# EAGLE design rgbw2 (EAGLE 6.6.0)
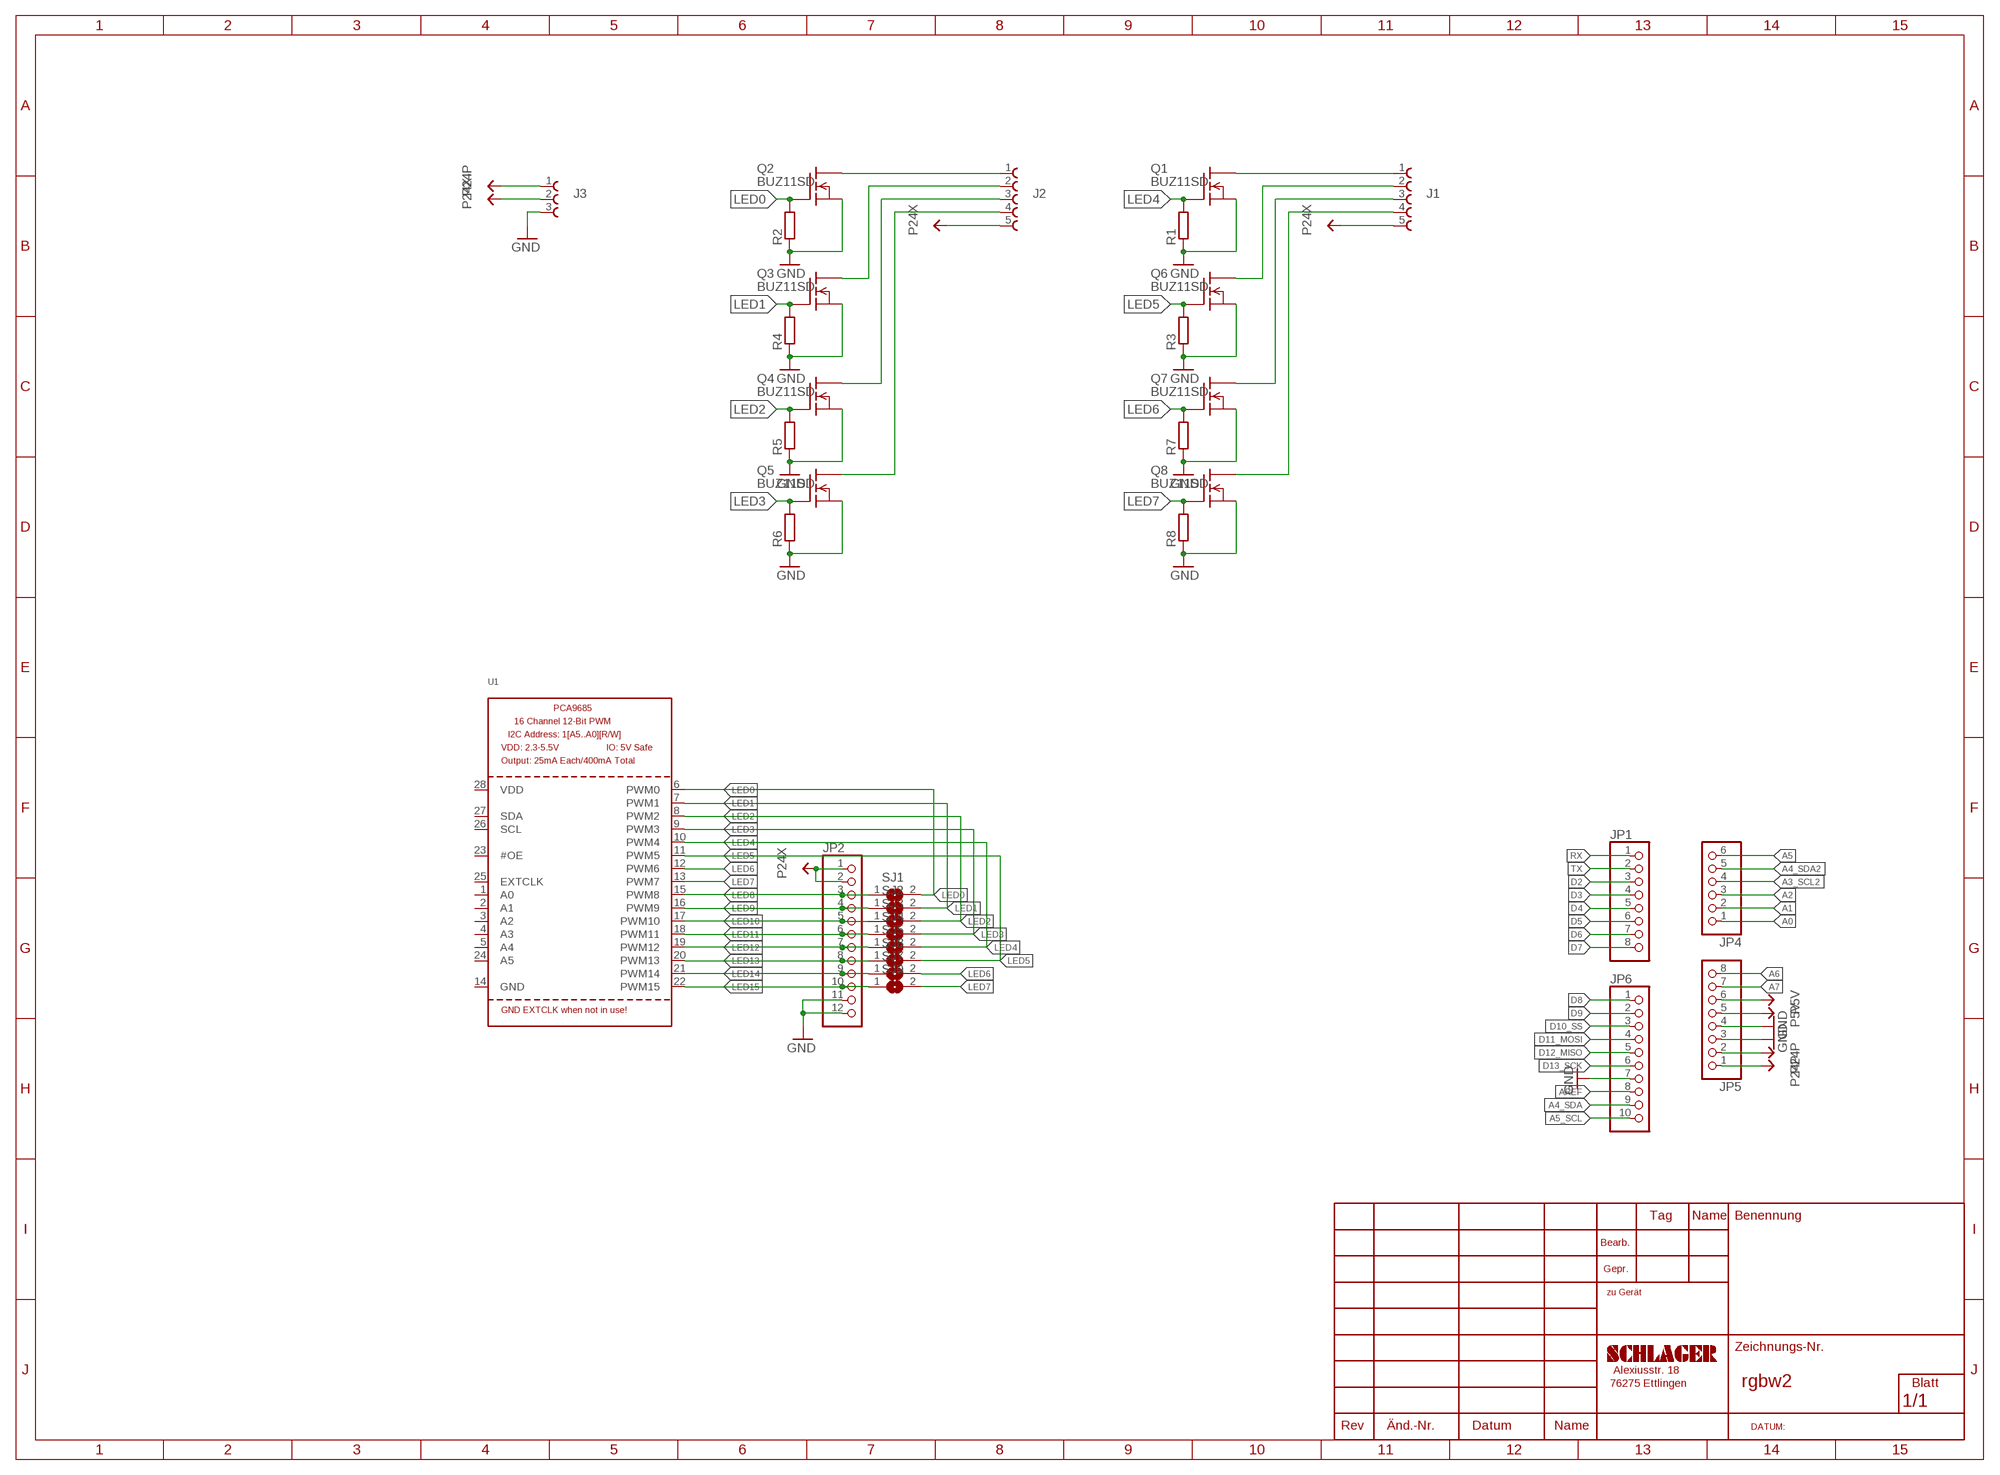
[diagram p0: schematic, sheet 1]

## Parts
J1  691322310005  [691322310005]
J2  691322310005  [691322310005]
J3  691313510003  [691313510003]
JP1  PINHD-1X8  [1X08]
JP2  PINHD-1X12  [1X12]
JP4  PINHD-1X6  [1X06]
JP5  PINHD-1X8  [1X08]
JP6  PINHD-1X10  [1X10]
Q1  BUZ11SD  [TO220]
Q2  BUZ11SD  [TO220]
Q3  BUZ11SD  [TO220]
Q4  BUZ11SD  [TO220]
Q5  BUZ11SD  [TO220]
Q6  BUZ11SD  [TO220]
Q7  BUZ11SD  [TO220]
Q8  BUZ11SD  [TO220]
R1  R-EU_R0805  [R0805]
R2  R-EU_R0805  [R0805]
R3  R-EU_R0805  [R0805]
R4  R-EU_R0805  [R0805]
R5  R-EU_R0805  [R0805]
R6  R-EU_R0805  [R0805]
R7  R-EU_R0805  [R0805]
R8  R-EU_R0805  [R0805]
SJ1  SJ  [SJ]
SJ2  SJ  [SJ]
SJ3  SJ  [SJ]
SJ4  SJ  [SJ]
SJ5  SJ  [SJ]
SJ7  SJ  [SJ]
SJ8  SJ  [SJ]
SJ9  SJ  [SJ]
U1  PCA9685  [TSSOP28]

## Nets
A0: JP4.1
A1: JP4.2
A2: JP4.3
A3_SCL2: JP4.4
A4_SDA: JP6.9
A4_SDA2: JP4.5
A5: JP4.6
A5_SCL: JP6.10
A6: JP5.8
A7: JP5.7
AREF: JP6.8
D2: JP1.3
D3: JP1.4
D4: JP1.5
D5: JP1.6
D6: JP1.7
D7: JP1.8
D8: JP6.1
D9: JP6.2
D10_SS: JP6.3
D11_MOSI: JP6.4
D12_MISO: JP6.5
D13_SCK: JP6.6
GND: J3.3 JP2.11 JP2.12 JP5.3 JP5.4 JP6.7 Q1.3(S) Q2.3(S) Q3.3(S) Q4.3(S) Q5.3(S) Q6.3(S) Q7.3(S) Q8.3(S) R1.1 R2.1 R3.1 R4.1 R5.1 R6.1 R7.1 R8.1
LED0: Q2.1(G) R2.2 SJ1.2 U1.6(PWM0)
LED1: Q3.1(G) R4.2 SJ2.2 U1.7(PWM1)
LED2: Q4.1(G) R5.2 SJ3.2 U1.8(PWM2)
LED3: Q5.1(G) R6.2 SJ4.2 U1.9(PWM3)
LED4: Q1.1(G) R1.2 SJ5.2 U1.10(PWM4)
LED5: Q6.1(G) R3.2 SJ8.2 U1.11(PWM5)
LED6: Q7.1(G) R7.2 SJ7.2 U1.12(PWM6)
LED7: Q8.1(G) R8.2 SJ9.2 U1.13(PWM7)
LED8: JP2.3 SJ1.1 U1.15(PWM8)
LED9: JP2.4 SJ2.1 U1.16(PWM9)
LED10: JP2.5 SJ3.1 U1.17(PWM10)
LED11: JP2.6 SJ4.1 U1.18(PWM11)
LED12: JP2.7 SJ5.1 U1.19(PWM12)
LED13: JP2.8 SJ8.1 U1.20(PWM13)
LED14: JP2.9 SJ7.1 U1.21(PWM14)
LED15: JP2.10 SJ9.1 U1.22(PWM15)
N$2: J2.1 Q2.2(D)
N$3: J2.2 Q3.2(D)
N$4: J1.3 Q7.2(D)
N$5: J2.3 Q4.2(D)
N$6: J2.4 Q5.2(D)
N$7: J1.4 Q8.2(D)
N$8: J1.1 Q1.2(D)
N$9: J1.2 Q6.2(D)
P5V: JP5.5 JP5.6
P24P: J3.1 JP5.1 JP5.2
P24X: J1.5 J2.5 J3.2 JP2.1 JP2.2
RX: JP1.1
TX: JP1.2
Unconnected: U1.1(A0) U1.2(A1) U1.3(A2) U1.4(A3) U1.5(A4) U1.23(#OE) U1.24(A5) U1.25(EXTCLK) U1.26(SCL) U1.27(SDA)

## Power pins joined to a net without a drawn wire
GND: U1.14(GND)
VDD: U1.28(VDD)

## Library data of the parts
J1 J2 = Eagle_TERMINAL_BLOCKS_rev16a:691322310005: WR-TBL Serie 322 - 3.81mm Vertical PCB Header , 5 Pins=>Code : Con_TBL_Pluggable_3.81_PCB_THT_Simple_691322310005 <http://katalog.we-online.de/media/images/eican/Con_TBL_Pluggable_3.81_PCB_THT_Simple_6913223100xx_pf2.jpg> Details see: http://katalog.we-online.de/en/em/691_322_310_0xx Created 2014-06-19, Karrer Zheng 2014 (C) Würth Elektronik
J3 = Eagle_TERMINAL_BLOCKS_rev16a:691313510003: WR-TBL Serie 313 - 5.08 mm Close Horizontal PCB Header , 3 Pins=>Code : Con_TBL_Pluggable_5.08_PCB_THT_Simple_H_691313510003 <http://katalog.we-online.de/media/images/eican/Con_TBL_Pluggable_5.08_PCB_THT_Simple_H_6913135100xx_pf2.jpg> Details see: http://katalog.we-online.de/en/em/691_313_510_0xx Created 2014-06-25, Karrer Zheng 2014 (C) Würth Elektronik
JP1 JP5 = pinhead:PINHD-1X8: PIN HEADER
JP2 = pinhead:PINHD-1X12: PIN HEADER
JP4 = pinhead:PINHD-1X6: PIN HEADER
JP6 = pinhead:PINHD-1X10: PIN HEADER
Q1-Q8 = transistor-fet:BUZ11: N-Channel Enhancement MOSFET 50V; 30A; 0,040Ohm
R1-R8 = schlager_passiv:R-EU_: RESISTOR, European symbol
SJ1-SJ5 SJ7-SJ9 = jumper:SJ: SMD solder JUMPER
U1 = adafruit:PCA9685: PCA9685 - 16 Channel 12-Bit I2C PWM Controller 5.0V tolerant 16 channel, 12-bit I2C PWM controller with 25mA per output (max. 400mA total) Digikey: 568-5931-1-ND

## Net classes
4 USBpair: width 0.254 mm, drill 0.406 mm, clearance 0.508 mm

## Board
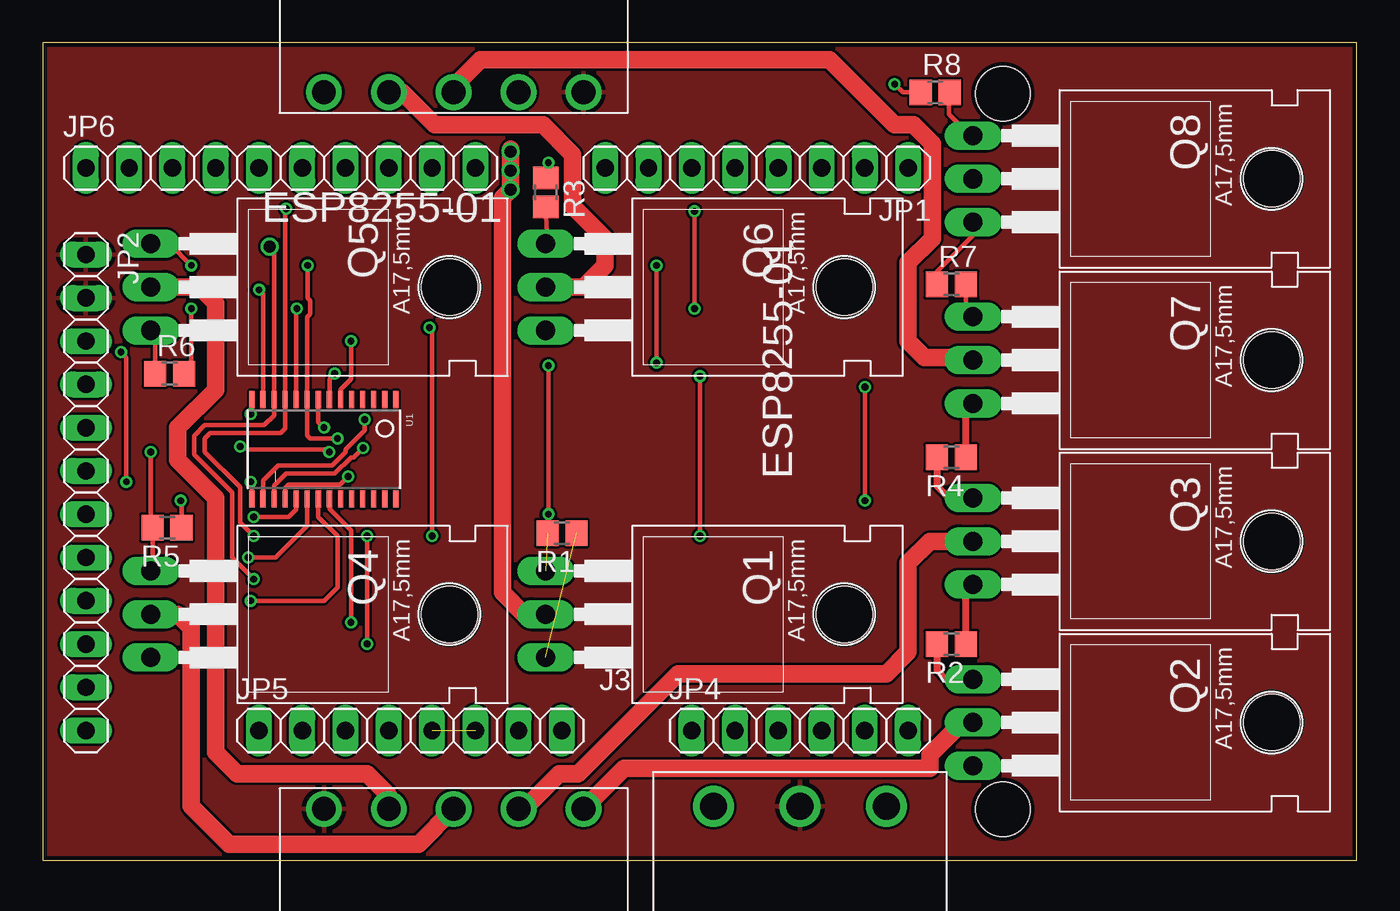
[diagram p1: board, top side]
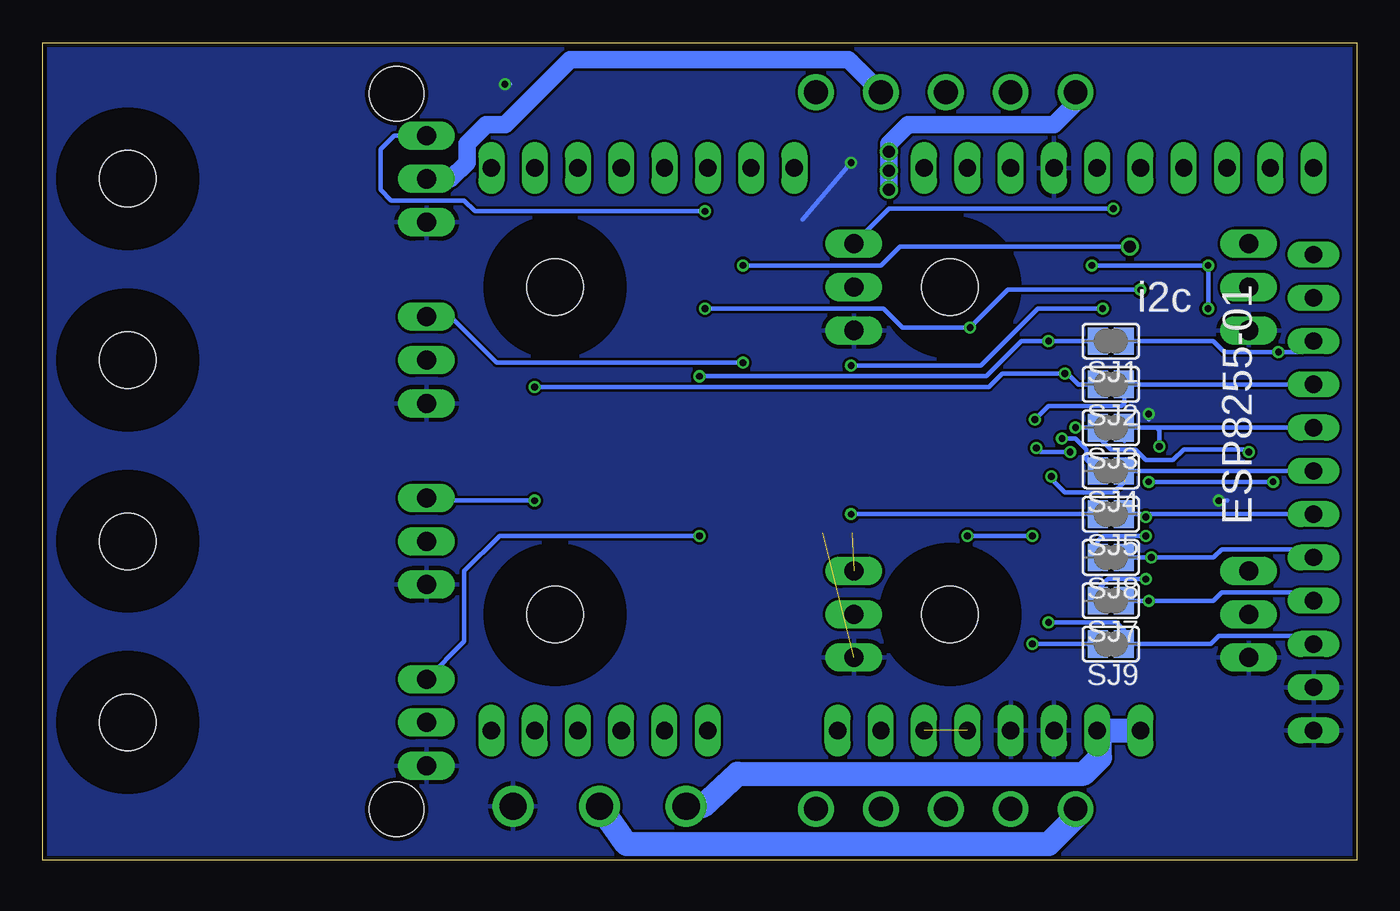
[diagram p2: board, bottom side, seen from below]

Size 77.14 x 48 mm. Coordinates in mm from the lower left corner, seen from the top.
Outline: 0,0 77.14,0 77.14,48 0,48 0,0
Copper layers (1*16): Top 0.035mm / dielectric 1.5mm / Bottom 0.035mm
Design rules "ITEADstudio_DRC": minimum track width 6mil, minimum drill 12mil, track to track 6mil, track to pad 6mil, pad to pad 6mil, via to via 6mil, smd to smd 0mil, copper to edge 10mil, drill to drill 10mil, minimum pad ring 10mil, minimum via ring 6mil, stop-mask expansion 2mil, vias tented up to drill 100mil, thermal gap 10mil
Holes 3.2 mm at 56.36,45 56.36,3

### Footprints (pad centres in the part's own frame; a part is rotated, then mirrored left to right if it is on the bottom)
691322310005 = drill 1.4: 1 -3.81,0; 2 0,0; 3 3.81,0; 4 7.62,0; 5 11.43,0
691313510003 = drill 1.6: 1 -5.08,0; 2 0,0; 3 5.08,0
1X08 = drill 1.016 long: 1 -8.89,0; 2 -6.35,0; 3 -3.81,0; 4 -1.27,0; 5 1.27,0; 6 3.81,0; 7 6.35,0; 8 8.89,0
1X12 = drill 1.016 long: 1 -13.97,0; 2 -11.43,0; 3 -8.89,0; 4 -6.35,0; 5 -3.81,0; 6 -1.27,0; 7 1.27,0; 8 3.81,0; 9 6.35,0; 10 8.89,0; 11 11.43,0; 12 13.97,0
1X06 = drill 1.016 long: 1 -6.35,0; 2 -3.81,0; 3 -1.27,0; 4 1.27,0; 5 3.81,0; 6 6.35,0
1X10 = drill 1.016 long: 1 -11.43,0; 2 -8.89,0; 3 -6.35,0; 4 -3.81,0; 5 -1.27,0; 6 1.27,0; 7 3.81,0; 8 6.35,0; 9 8.89,0; 10 11.43,0
TO220 = drill 1.118 long: 1 -2.54,-6.35; 2 0,-6.35; 3 2.54,-6.35 | hole 3.302: 0,11.176
R0805 = smd 1.3 x 1.5: 1 -0.85,0; 2 0.85,0
SJ = smd 1.168 x 1.6: 1 -0.762,0; 2 0.762,0
TSSOP28 = smd 0.305 x 0.991: 1 -4.225,-2.918; 2 -3.575,-2.918; 3 -2.925,-2.918; 4 -2.275,-2.918; 5 -1.625,-2.918; 6 -0.975,-2.918; 7 -0.325,-2.918; 8 0.325,-2.918; 9 0.975,-2.918; 10 1.625,-2.918; 11 2.275,-2.918; 12 2.925,-2.918; 13 3.575,-2.918; 14 4.225,-2.918; 15 4.225,2.918; 16 3.575,2.918; 17 2.925,2.918; 18 2.275,2.918; 19 1.625,2.918; 20 0.975,2.918; 21 0.325,2.918; 22 -0.325,2.918; 23 -0.975,2.918; 24 -1.625,2.918; 25 -2.275,2.918; 26 -2.925,2.918; 27 -3.575,2.918; 28 -4.225,2.918

### Placement (x,y rotation side)
J1  20.32,45.09 0 top
J2  27.94,3.02 180 top
J3  44.45,3.17 0 top
JP1  41.91,40.64 180 top
JP2  2.54,21.59 270 top
JP4  44.45,7.62 0 top
JP5  21.59,7.62 0 top
JP6  13.97,40.64 0 top
Q1  35.88,14.45 270 top
Q2  60.96,8.1 270 top
Q3  60.96,18.73 270 top
Q4  12.7,14.45 270 top
Q5  12.7,33.66 270 top
Q6  35.88,33.66 270 top
Q7  60.96,29.37 270 top
Q8  60.96,40.01 270 top
R1  30.48,19.21 180 top
R2  53.34,12.7 180 top
R3  29.53,39.21 270 top
R4  53.34,23.65 180 top
R5  7.3,19.53 180 top
R6  7.46,28.57 0 top
R7  53.34,33.81 0 top
R8  52.39,45.09 0 top
SJ1  14.45,30.48 180 bottom
SJ2  14.45,27.94 180 bottom
SJ3  14.45,25.4 180 bottom
SJ4  14.45,22.86 180 bottom
SJ5  14.45,20.32 180 bottom
SJ7  14.45,15.24 180 bottom
SJ8  14.45,17.78 180 bottom
SJ9  14.45,12.7 180 bottom
U1  16.51,24.13 180 top

### Tracks (layer width: path | path; a pad name or v marks a point on that pad's centre or on a via)
GND  (via drill 0.4)  (1 unrouted)
  Top 0.254: R6.1 6.61,30.85 Q5.3 | U1.14 12.29,26.25 v12.22,26.19 | R5.1 8.15,21.06 v8.1,21.11 | R3.1 29.53,40.48 v29.69,40.96 | R7.1 52.49,34.55 54.61,36.67 Q8.3 | R8.1 50.48,45.09 v50.01,45.56
  Top 0.406: R4.1 54.19,26.41 Q7.3 | R2.1 54.19,15.77 Q3.3
  Bottom 0.254: v12.22,26.19 12.22,25.88 | v8.1,21.11 7.62,21.11 | v29.69,40.96 32.54,37.62 | v50.01,45.56 49.69,45.56
  pour Bottom: -49.53,72.39 80.01,72.39 80.01,-13.97 -49.53,-13.97
LED0  (via drill 0.4)
  Top 0.254: U1.6 17.48,27.64 18.1,28.26 v18.1,30.48 | v38.58,28.42 v38.58,19.05
  Top 0.406: R2.2 52.49,11.17 53.02,10.64 Q2.1
  Bottom 0.254: SJ1.2 v18.1,30.48 19.68,30.48 21.75,28.42 v38.58,28.42 | v38.58,19.05 50.32,19.05 52.39,16.99 52.39,12.86 Q2.1
LED1  (via drill 0.4)
  Top 0.254: U1.7 16.84,28.27 v17.14,28.57 | v48.26,27.78 v48.26,21.11
  Top 0.406: R4.2 52.49,21.96 53.18,21.27 Q3.1
  Bottom 0.254: SJ2.2 16.35,27.94 16.99,28.57 v17.14,28.57 20.8,28.57 21.59,27.78 v48.26,27.78 | v48.26,21.11 54.45,21.11 Q3.1
LED2  (via drill 0.4)
  Top 0.254: Q4.1 6.45,17.09 R5.2 6.35,19.63 v6.35,23.97 | U1.8 16.18,25.73 v16.51,25.4
  Bottom 0.254: v16.51,25.4 SJ3.2 15.21,24.89 14.45,24.13 13.02,24.13 12.38,23.5 10.79,23.5 10.16,24.13 6.51,24.13 v6.35,23.97
LED3  (via drill 0.4)
  Top 0.254: Q5.1 7.46,36.2 v8.73,34.92 | v8.73,32.38 8.73,29 R6.2 | 15.54,34.9 v15.56,34.92 15.56,33.02 15.72,32.86 15.72,32.07 15.54,31.89 U1.9 15.54,24.95 15.72,24.77 v17.3,24.77
  Bottom 0.254: v8.73,32.38 v8.73,34.92 v15.56,34.92 | v17.3,24.77 16.51,24.77 15.88,24.13 15.88,23.53 SJ4.2
LED4  (via drill 0.4)  (1 unrouted)
  Top 0.254: U1.10 14.88,32.35 v14.92,32.38 | v29.69,29.05 v29.69,20.32 | v29.69,20.32 29.69,19.27 R1.2 29.63,20.26 v29.69,20.32
  Bottom 0.254: v14.92,32.38 18.73,32.38 22.07,29.05 v29.69,29.05 | v29.69,20.32 SJ5.2
LED5  (via drill 0.4)
  Top 0.254: v14.29,38.26 14.23,38.21 U1.11 14.23,25.35 13.97,25.08 9.84,25.08 9.53,24.77 9.53,23.97 11.59,21.91 11.59,19.84 v12.38,19.05 | R3.2 29.63,36.3 Q6.1
  Bottom 0.254: v14.29,38.26 27.46,38.26 Q6.1 | v12.38,19.05 14.92,19.05 15.24,18.73 15.24,17.81 SJ8.2
LED6  (via drill 0.4, 0.7)
  Top 0.254: v13.34,36.04 13.59,35.95 U1.12 13.59,26.13 13.02,25.56 9.53,25.56 8.89,24.92 8.89,23.81 11.11,21.59 11.11,17.78 v12.38,16.51 | R7.2 54.19,32.33 Q7.1 | v36.04,34.92 v36.04,29.21
  Bottom 0.254: v13.34,36.04 26.83,36.04 27.94,34.92 v36.04,34.92 | v36.04,29.21 50.48,29.21 53.34,32.07 53.93,32.07 54.19,32.33 Q7.1 | v12.38,16.51 14.61,16.51 15.08,16.03 15.08,15.37 SJ7.2
LED7  (via drill 0.4)
  Top 0.254: Q8.1 54.45,42.55 53.18,43.81 53.18,45.03 R8.2 | U1.13 12.94,33.26 v12.7,33.5 | v38.26,32.38 v38.26,38.1 | v19.05,12.7 v19.05,19.05 | v22.86,19.05 22.86,31.11 v22.7,31.27
  Bottom 0.254: v12.7,33.5 20.48,33.5 21.91,32.07 v22.7,31.27 26.67,31.27 27.78,32.38 v38.26,32.38 | v38.26,38.1 51.75,38.1 52.39,38.73 56.67,38.73 57.31,39.37 57.31,41.75 56.52,42.55 Q8.1 | SJ9.2 v19.05,12.7 | v19.05,19.05 v22.86,19.05
LED8  (via drill 0.4)
  Top 0.254: U1.15 12.29,22.16 v12.22,22.23 | v4.92,22.23 4.92,29.53 v4.6,29.84
  Bottom 0.254: SJ1.1 8.41,30.48 7.78,29.84 5.08,29.84 v4.6,29.84 3.17,29.84 JP2.3 | v12.22,22.23 v4.92,22.23
LED9  (via drill 0.4)
  Top 0.254: U1.16 12.94,22.3 13.81,23.18 16.99,23.18 17.78,23.97 17.78,24.13 18.89,25.24 v18.89,25.88
  Bottom 0.254: JP2.4 SJ2.1 13.65,27.91 13.65,26.83 13.81,26.67 18.1,26.67 v18.89,25.88
LED10  (via drill 0.4)
  Top 0.254: U1.17 13.59,22 14.29,22.7 17.14,22.7 18.1,23.65 18.26,23.65 v18.81,24.21 | v11.59,24.29 12.06,24.13 16.51,24.13 v16.83,23.97
  Bottom 0.254: 11.75,25.4 SJ3.1 13.65,25.37 13.65,24.61 | 11.75,25.4 JP2.5 | v11.59,24.29 11.59,25.24 11.75,25.4 | v16.83,23.97 18.57,23.97 v18.81,24.21
LED11  (via drill 0.4)  (1 unrouted)
  Top 0.254: U1.18 14.23,21.86 14.45,22.07 17.46,22.07 v17.94,22.54
  Bottom 0.254: JP2.6 SJ4.1 13.65,22.83 | v17.94,22.54 17.94,22.38 17.14,21.59 14.29,21.59 13.65,22.23
LED12  (via drill 0.4)
  Top 0.254: U1.19 14.88,20.6 14.45,20.16 v12.38,20.16
  Bottom 0.254: SJ5.1 12.7,20.32 v12.38,20.16 12.22,20.32 JP2.7
LED13  (via drill 0.4)
  Top 0.254: U1.20 15.54,19.63 SJ8.1 v12.06,17.78
  Bottom 0.254: JP2.8 3.02,18.26 7.94,18.26 8.41,17.78 v12.06,17.78 SJ8.1
LED14  (via drill 0.4)
  Top 0.254: U1.21 16.18,20.17 17.3,19.05 17.3,16.03 16.51,15.24 v12.22,15.24
  Bottom 0.254: SJ7.1 13.18,15.24 v12.22,15.24 8.41,15.24 7.94,15.72 3.02,15.72 JP2.9
LED15  (via drill 0.4)
  Top 0.254: U1.22 16.84,20.63 18.1,19.37 v18.1,13.97
  Bottom 0.254: JP2.10 3.02,13.18 8.1,13.18 8.57,12.7 SJ9.1 13.65,12.73 13.65,13.49 14.13,13.97 v18.1,13.97
N$2
  Top 1.016: Q2.2 53.98,8.1 52.07,6.19 52.07,5.4 34.13,5.4 J2.1
N$3
  Top 1.016: J2.2 28.26,3.02 30.32,5.08 31.43,5.08 37.31,10.95 49.53,10.95 50.8,12.22 50.8,17.46 52.07,18.73 Q3.2
N$4
  Top 1.016: J1.3 24.13,45.4 25.72,46.99 46.2,46.99 50.01,43.18 51.12,43.18 52.23,42.07 52.23,36.51 50.8,35.08 50.8,30.48 51.75,29.53 54.45,29.53 Q7.2
N$5
  Top 1.016: Q4.2 7.94,14.45 8.73,13.65 8.73,3.17 10.95,0.95 22.07,0.95 J2.3
N$6
  Top 1.016: J2.4 20.32,3.81 19.05,5.08 11.43,5.08 10.16,6.35 10.16,21.27 7.94,23.5 7.94,25.4 10.16,27.62 10.16,32.7 9.21,33.66 Q5.2
N$7
  Bottom 1.016: J1.4 29.84,46.99 46.2,46.99 50.01,43.18 51.12,43.18 52.23,42.07 52.23,40.96 53.18,40.01 Q8.2
N$8  (via drill 0.7)
  Top 1.016: Q1.2 28.26,14.45 26.99,15.72 26.99,38.89 v27.46,39.37 v27.46,40.48 27.46,41.75
  Bottom 1.016: J1.1 16.51,44.45 17.78,43.18 26.35,43.18 27.46,42.07 v27.46,41.59 v27.46,40.48 v27.46,39.37
N$9
  Top 1.016: J1.2 21.11,45.09 23.02,43.18 29.37,43.18 31.11,41.43 31.11,38.42 33.02,36.51 33.02,34.92 31.75,33.66 Q6.2
P5V  (1 unrouted)
P24P
  Bottom 1.422: J3.1 38.42,3.17 36.35,5.08 16.03,5.08 15.08,6.03 15.08,7.46 JP5.2 JP5.1
P24X
  Bottom 1.422: J2.5 16.51,2.54 18.1,0.95 42.86,0.95 J3.2
  pour Top (rank 5): -37.31,71.12 85.09,69.85 85.09,-12.7 -37.62,-12.54

### Text on the board
tNames: ESP8255-01 | ESP8255-01
bNames: ESP8255-01 | i2c